# EAGLE schematic Pots (EAGLE 7.4.0)
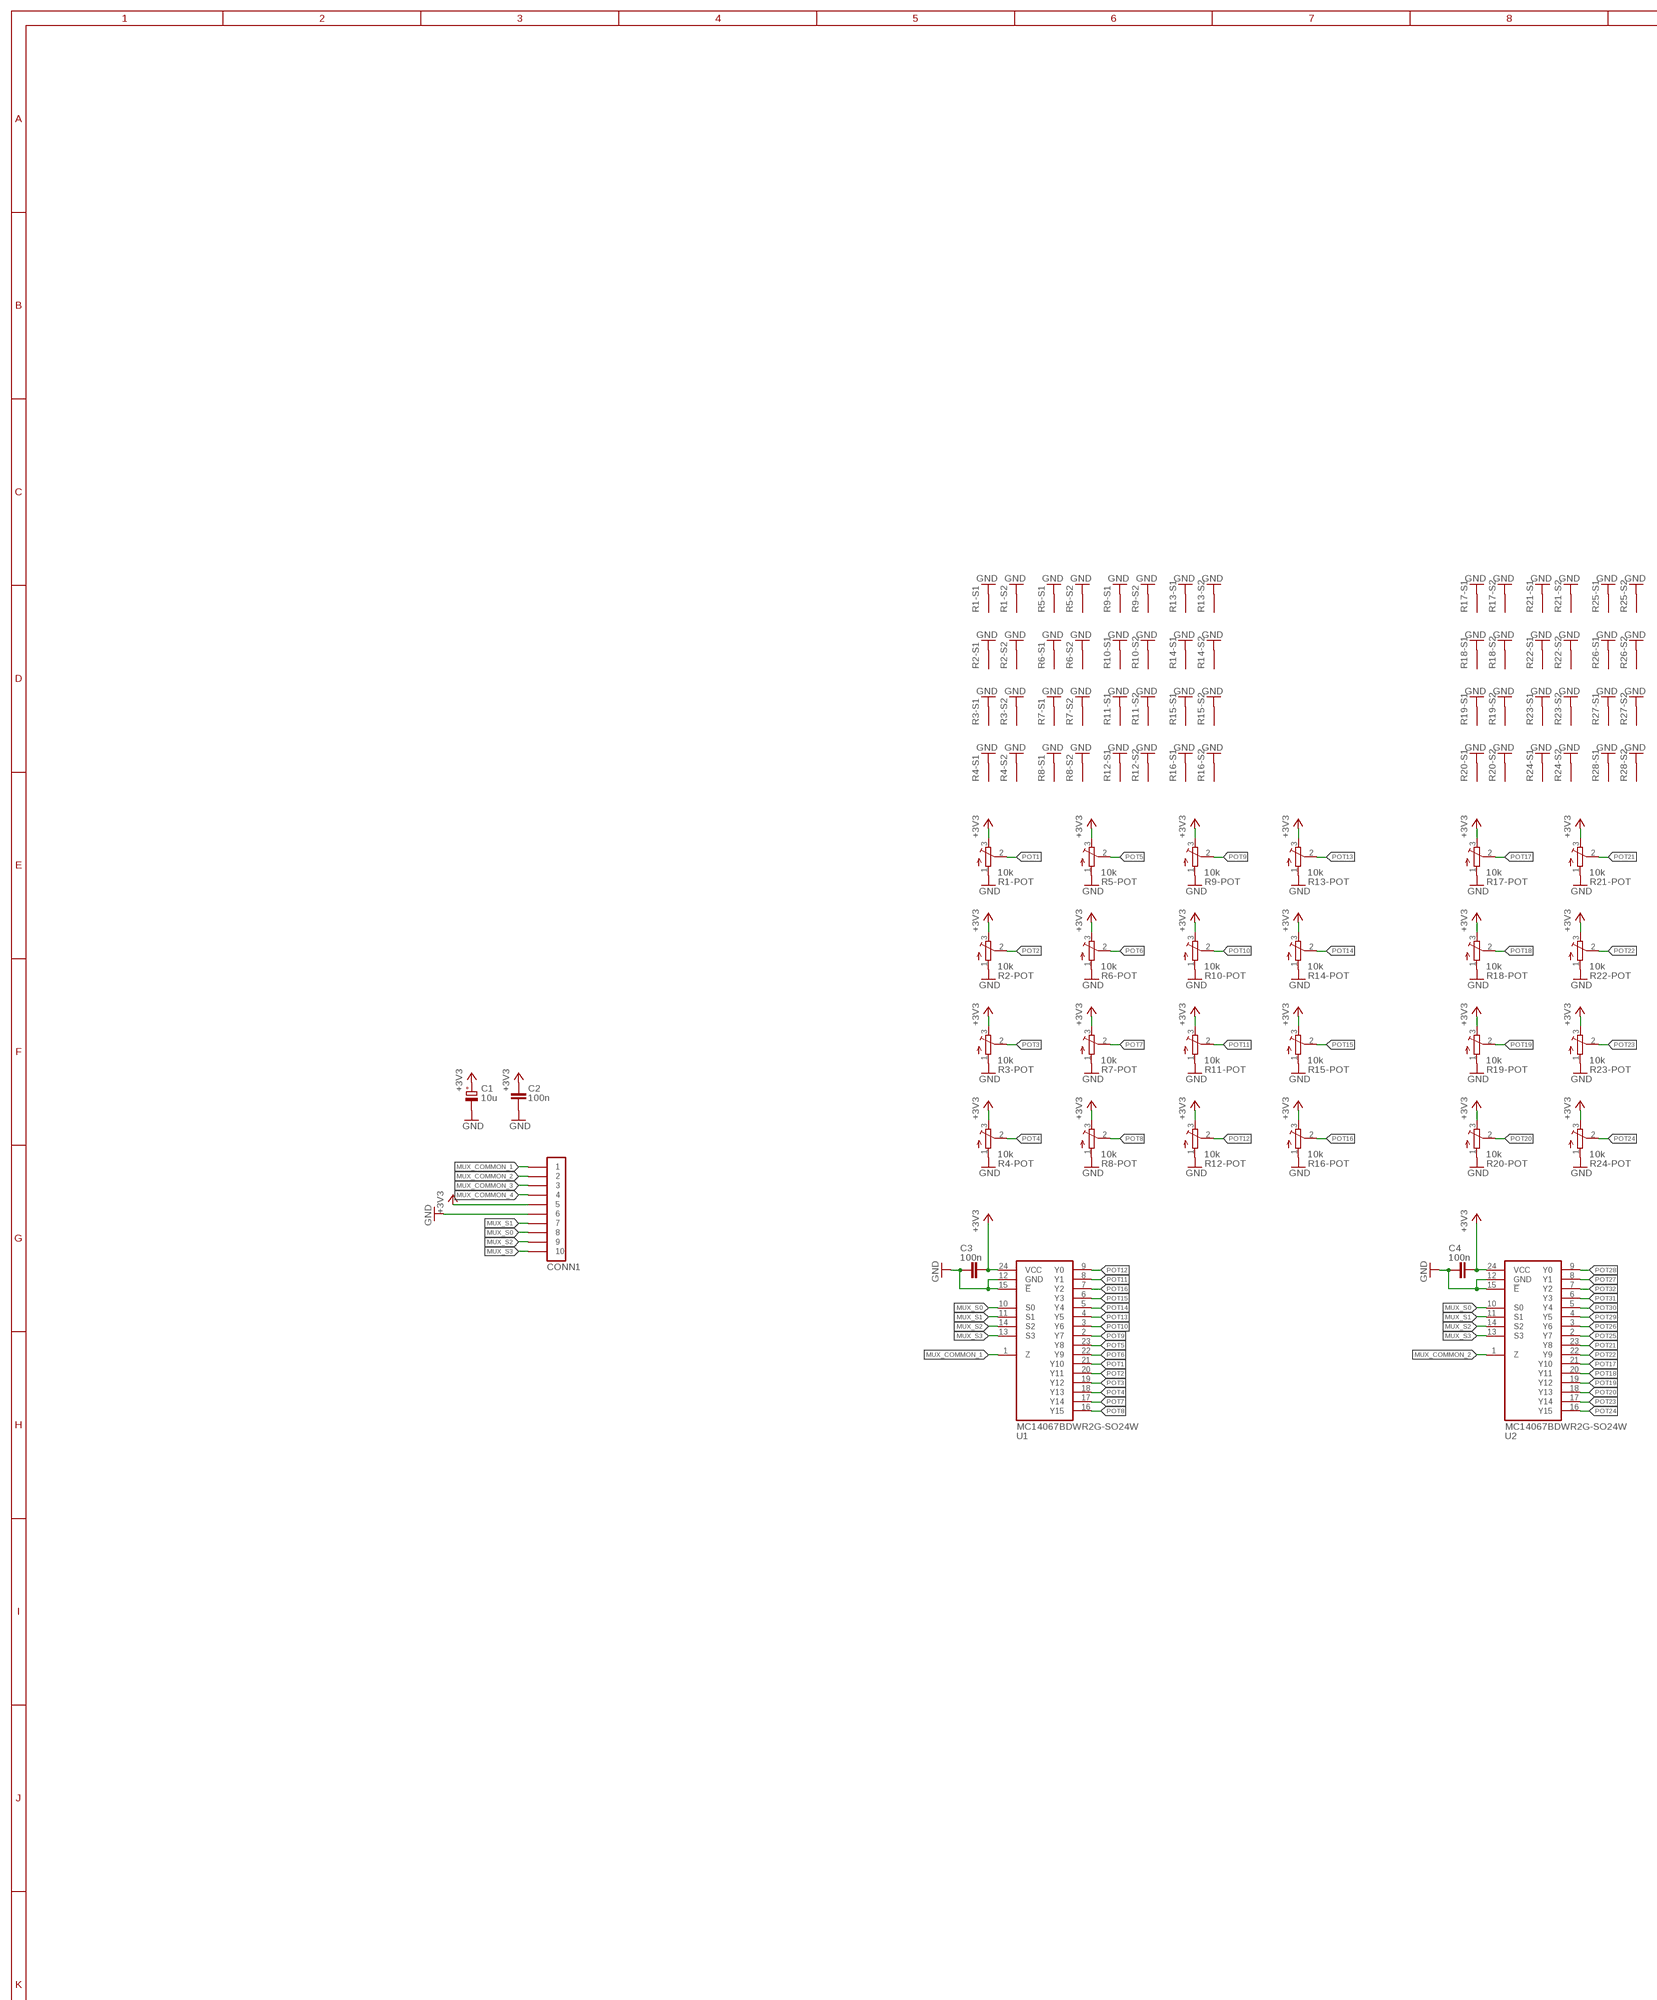
[diagram p0: schematic, sheet 1, part 1 of 3]
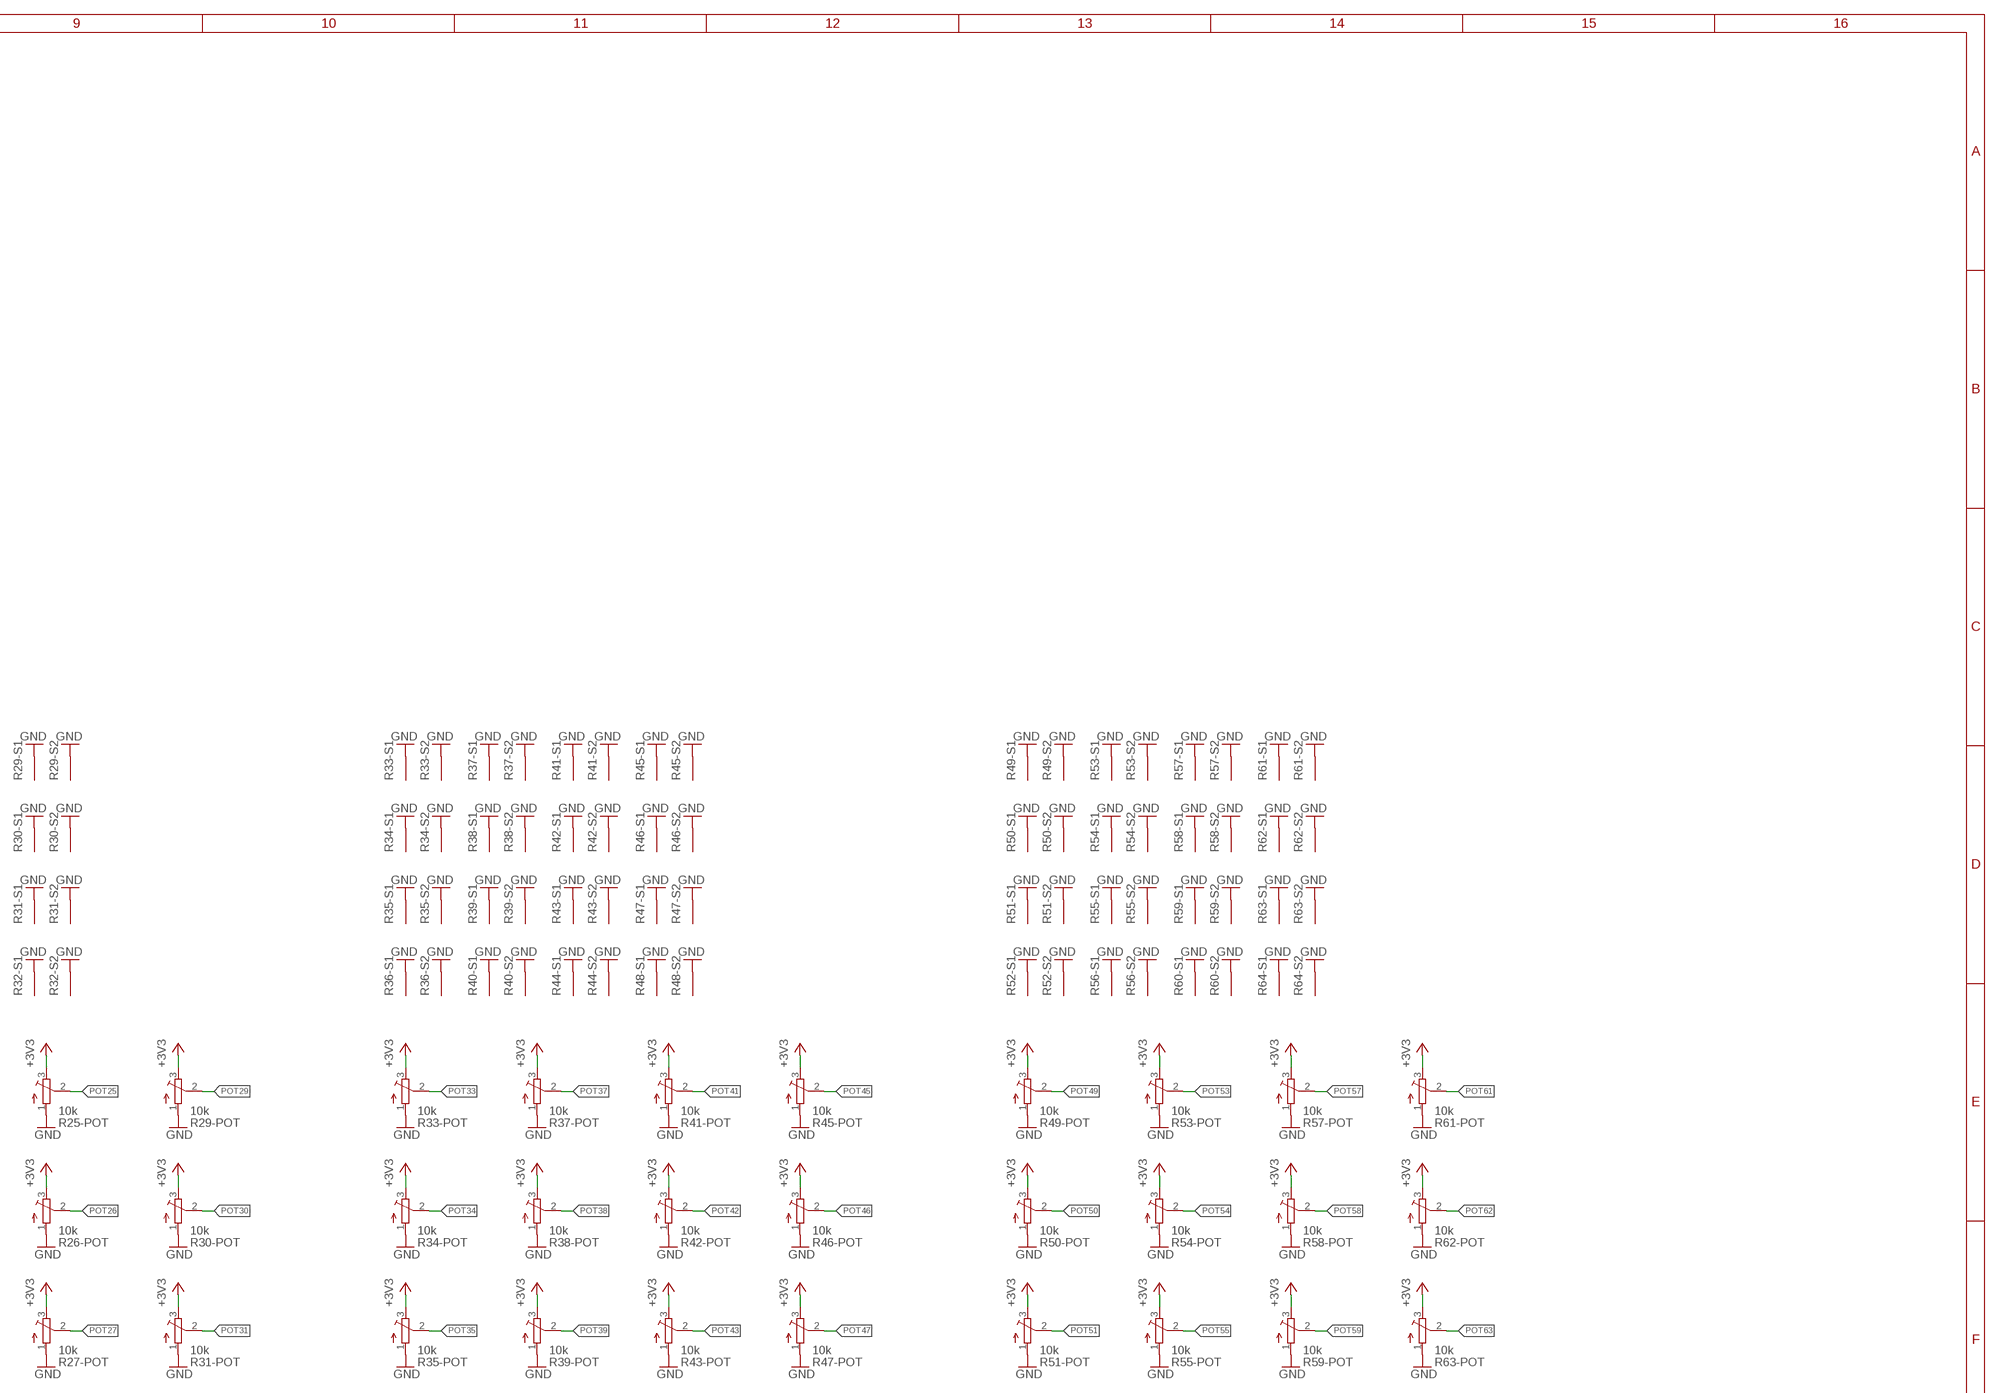
[diagram p1: schematic, sheet 1, part 2 of 3]
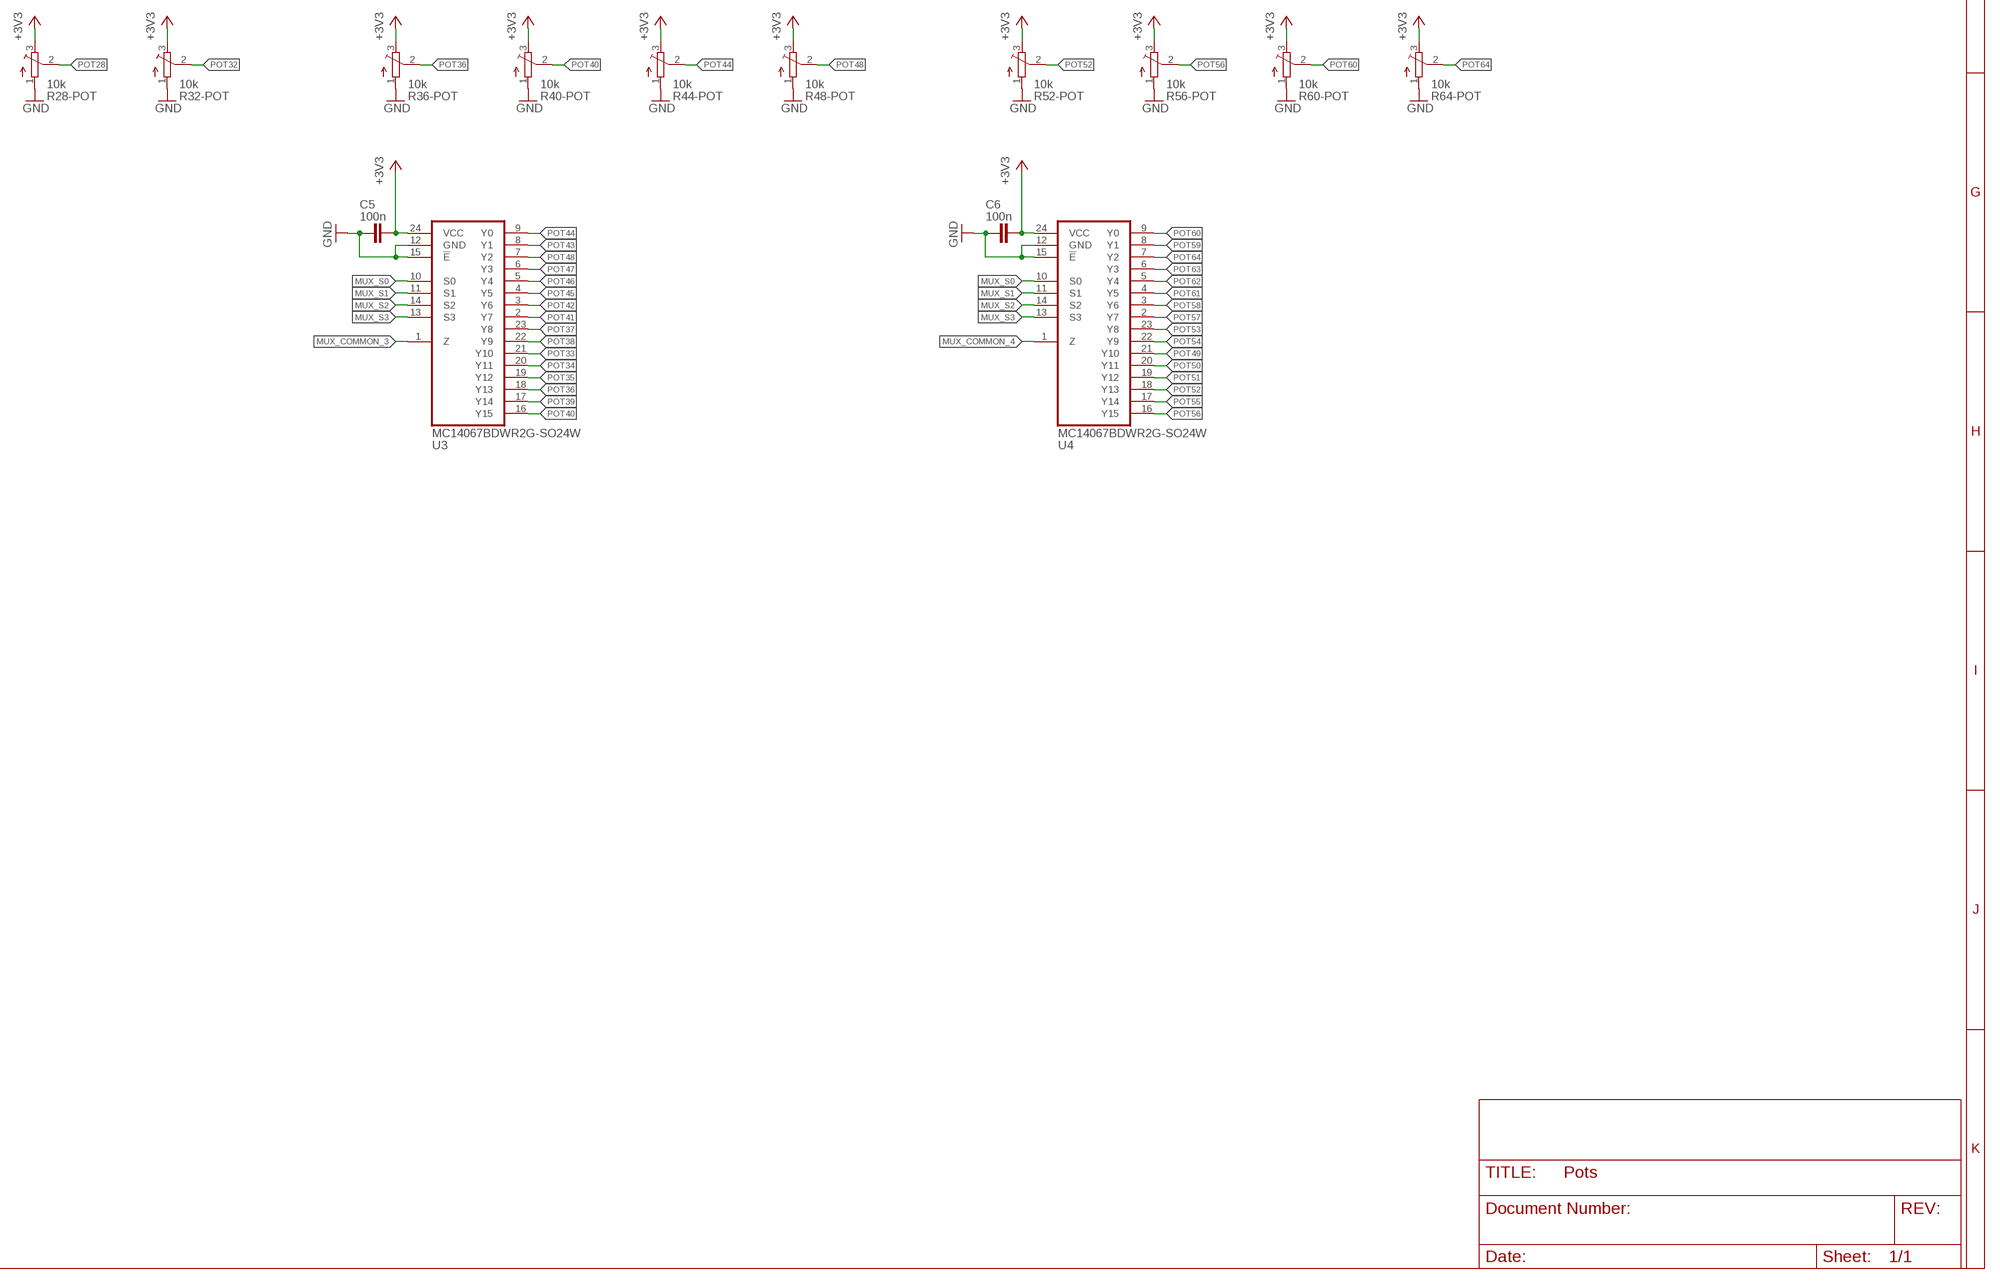
[diagram p2: schematic, sheet 1, part 3 of 3]

## Parts
C1  10u  ELECTROLYTIC_CAPACITOR-C-TH-E-0401  [C-TH-E-0401]
C2  100n  CAPACITOR-0805  [C0805]
C3  100n  CAPACITOR-0805  [C0805]
C4  100n  CAPACITOR-0805  [C0805]
C5  100n  CAPACITOR-0805  [C0805]
C6  100n  CAPACITOR-0805  [C0805]
CONN1  PINHD-1X10-FFC-1MM-Z  [MOLEX-52271-1079]
R1  10k  PTV09A-4025F-B103  [PTV09A-4025F-B103]
R2  10k  PTV09A-4025F-B103  [PTV09A-4025F-B103]
R3  10k  PTV09A-4025F-B103  [PTV09A-4025F-B103]
R4  10k  PTV09A-4025F-B103  [PTV09A-4025F-B103]
R5  10k  PTV09A-4025F-B103  [PTV09A-4025F-B103]
R6  10k  PTV09A-4025F-B103  [PTV09A-4025F-B103]
R7  10k  PTV09A-4025F-B103  [PTV09A-4025F-B103]
R8  10k  PTV09A-4025F-B103  [PTV09A-4025F-B103]
R9  10k  PTV09A-4025F-B103  [PTV09A-4025F-B103]
R10  10k  PTV09A-4025F-B103  [PTV09A-4025F-B103]
R11  10k  PTV09A-4025F-B103  [PTV09A-4025F-B103]
R12  10k  PTV09A-4025F-B103  [PTV09A-4025F-B103]
R13  10k  PTV09A-4025F-B103  [PTV09A-4025F-B103]
R14  10k  PTV09A-4025F-B103  [PTV09A-4025F-B103]
R15  10k  PTV09A-4025F-B103  [PTV09A-4025F-B103]
R16  10k  PTV09A-4025F-B103  [PTV09A-4025F-B103]
R17  10k  PTV09A-4025F-B103  [PTV09A-4025F-B103]
R18  10k  PTV09A-4025F-B103  [PTV09A-4025F-B103]
R19  10k  PTV09A-4025F-B103  [PTV09A-4025F-B103]
R20  10k  PTV09A-4025F-B103  [PTV09A-4025F-B103]
R21  10k  PTV09A-4025F-B103  [PTV09A-4025F-B103]
R22  10k  PTV09A-4025F-B103  [PTV09A-4025F-B103]
R23  10k  PTV09A-4025F-B103  [PTV09A-4025F-B103]
R24  10k  PTV09A-4025F-B103  [PTV09A-4025F-B103]
R25  10k  PTV09A-4025F-B103  [PTV09A-4025F-B103]
R26  10k  PTV09A-4025F-B103  [PTV09A-4025F-B103]
R27  10k  PTV09A-4025F-B103  [PTV09A-4025F-B103]
R28  10k  PTV09A-4025F-B103  [PTV09A-4025F-B103]
R29  10k  PTV09A-4025F-B103  [PTV09A-4025F-B103]
R30  10k  PTV09A-4025F-B103  [PTV09A-4025F-B103]
R31  10k  PTV09A-4025F-B103  [PTV09A-4025F-B103]
R32  10k  PTV09A-4025F-B103  [PTV09A-4025F-B103]
R33  10k  PTV09A-4025F-B103  [PTV09A-4025F-B103]
R34  10k  PTV09A-4025F-B103  [PTV09A-4025F-B103]
R35  10k  PTV09A-4025F-B103  [PTV09A-4025F-B103]
R36  10k  PTV09A-4025F-B103  [PTV09A-4025F-B103]
R37  10k  PTV09A-4025F-B103  [PTV09A-4025F-B103]
R38  10k  PTV09A-4025F-B103  [PTV09A-4025F-B103]
R39  10k  PTV09A-4025F-B103  [PTV09A-4025F-B103]
R40  10k  PTV09A-4025F-B103  [PTV09A-4025F-B103]
R41  10k  PTV09A-4025F-B103  [PTV09A-4025F-B103]
R42  10k  PTV09A-4025F-B103  [PTV09A-4025F-B103]
R43  10k  PTV09A-4025F-B103  [PTV09A-4025F-B103]
R44  10k  PTV09A-4025F-B103  [PTV09A-4025F-B103]
R45  10k  PTV09A-4025F-B103  [PTV09A-4025F-B103]
R46  10k  PTV09A-4025F-B103  [PTV09A-4025F-B103]
R47  10k  PTV09A-4025F-B103  [PTV09A-4025F-B103]
R48  10k  PTV09A-4025F-B103  [PTV09A-4025F-B103]
R49  10k  PTV09A-4025F-B103  [PTV09A-4025F-B103]
R50  10k  PTV09A-4025F-B103  [PTV09A-4025F-B103]
R51  10k  PTV09A-4025F-B103  [PTV09A-4025F-B103]
R52  10k  PTV09A-4025F-B103  [PTV09A-4025F-B103]
R53  10k  PTV09A-4025F-B103  [PTV09A-4025F-B103]
R54  10k  PTV09A-4025F-B103  [PTV09A-4025F-B103]
R55  10k  PTV09A-4025F-B103  [PTV09A-4025F-B103]
R56  10k  PTV09A-4025F-B103  [PTV09A-4025F-B103]
R57  10k  PTV09A-4025F-B103  [PTV09A-4025F-B103]
R58  10k  PTV09A-4025F-B103  [PTV09A-4025F-B103]
R59  10k  PTV09A-4025F-B103  [PTV09A-4025F-B103]
R60  10k  PTV09A-4025F-B103  [PTV09A-4025F-B103]
R61  10k  PTV09A-4025F-B103  [PTV09A-4025F-B103]
R62  10k  PTV09A-4025F-B103  [PTV09A-4025F-B103]
R63  10k  PTV09A-4025F-B103  [PTV09A-4025F-B103]
R64  10k  PTV09A-4025F-B103  [PTV09A-4025F-B103]
U1  MC14067BDWR2G-SO24W  [SO24-W]
U2  MC14067BDWR2G-SO24W  [SO24-W]
U3  MC14067BDWR2G-SO24W  [SO24-W]
U4  MC14067BDWR2G-SO24W  [SO24-W]

## Nets
+3V3: C1.+ C2.1 C3.2 C4.2 C5.2 C6.2 CONN1.5 R1.3 R2.3 R3.3 R4.3 R5.3 R6.3 R7.3 R8.3 R9.3 R10.3 R11.3 R12.3 R13.3 R14.3 R15.3 R16.3 R17.3 R18.3 R19.3 R20.3 R21.3 R22.3 R23.3 R24.3 R25.3 R26.3 R27.3 R28.3 R29.3 R30.3 R31.3 R32.3 R33.3 R34.3 R35.3 R36.3 R37.3 R38.3 R39.3 R40.3 R41.3 R42.3 R43.3 R44.3 R45.3 R46.3 R47.3 R48.3 R49.3 R50.3 R51.3 R52.3 R53.3 R54.3 R55.3 R56.3 R57.3 R58.3 R59.3 R60.3 R61.3 R62.3 R63.3 R64.3 U1.24(VCC) U2.24(VCC) U3.24(VCC) U4.24(VCC)
GND: C1.- C2.2 C3.1 C4.1 C5.1 C6.1 CONN1.6 R1.1 R1.S1(-S1:S) R1.S2(-S2:S) R2.1 R2.S1(-S1:S) R2.S2(-S2:S) R3.1 R3.S1(-S1:S) R3.S2(-S2:S) R4.1 R4.S1(-S1:S) R4.S2(-S2:S) R5.1 R5.S1(-S1:S) R5.S2(-S2:S) R6.1 R6.S1(-S1:S) R6.S2(-S2:S) R7.1 R7.S1(-S1:S) R7.S2(-S2:S) R8.1 R8.S1(-S1:S) R8.S2(-S2:S) R9.1 R9.S1(-S1:S) R9.S2(-S2:S) R10.1 R10.S1(-S1:S) R10.S2(-S2:S) R11.1 R11.S1(-S1:S) R11.S2(-S2:S) R12.1 R12.S1(-S1:S) R12.S2(-S2:S) R13.1 R13.S1(-S1:S) R13.S2(-S2:S) R14.1 R14.S1(-S1:S) R14.S2(-S2:S) R15.1 R15.S1(-S1:S) R15.S2(-S2:S) R16.1 R16.S1(-S1:S) R16.S2(-S2:S) R17.1 R17.S1(-S1:S) R17.S2(-S2:S) R18.1 R18.S1(-S1:S) R18.S2(-S2:S) R19.1 R19.S1(-S1:S) R19.S2(-S2:S) R20.1 R20.S1(-S1:S) R20.S2(-S2:S) R21.1 R21.S1(-S1:S) R21.S2(-S2:S) R22.1 R22.S1(-S1:S) R22.S2(-S2:S) R23.1 R23.S1(-S1:S) R23.S2(-S2:S) R24.1 R24.S1(-S1:S) R24.S2(-S2:S) R25.1 R25.S1(-S1:S) R25.S2(-S2:S) R26.1 R26.S1(-S1:S) R26.S2(-S2:S) R27.1 R27.S1(-S1:S) R27.S2(-S2:S) R28.1 R28.S1(-S1:S) R28.S2(-S2:S) R29.1 R29.S1(-S1:S) R29.S2(-S2:S) R30.1 R30.S1(-S1:S) R30.S2(-S2:S) R31.1 R31.S1(-S1:S) R31.S2(-S2:S) R32.1 R32.S1(-S1:S) R32.S2(-S2:S) R33.1 R33.S1(-S1:S) R33.S2(-S2:S) R34.1 R34.S1(-S1:S) R34.S2(-S2:S) R35.1 R35.S1(-S1:S) R35.S2(-S2:S) R36.1 R36.S1(-S1:S) R36.S2(-S2:S) R37.1 R37.S1(-S1:S) R37.S2(-S2:S) R38.1 R38.S1(-S1:S) R38.S2(-S2:S) R39.1 R39.S1(-S1:S) R39.S2(-S2:S) R40.1 R40.S1(-S1:S) R40.S2(-S2:S) R41.1 R41.S1(-S1:S) R41.S2(-S2:S) R42.1 R42.S1(-S1:S) R42.S2(-S2:S) R43.1 R43.S1(-S1:S) R43.S2(-S2:S) R44.1 R44.S1(-S1:S) R44.S2(-S2:S) R45.1 R45.S1(-S1:S) R45.S2(-S2:S) R46.1 R46.S1(-S1:S) R46.S2(-S2:S) R47.1 R47.S1(-S1:S) R47.S2(-S2:S) R48.1 R48.S1(-S1:S) R48.S2(-S2:S) R49.1 R49.S1(-S1:S) R49.S2(-S2:S) R50.1 R50.S1(-S1:S) R50.S2(-S2:S) R51.1 R51.S1(-S1:S) R51.S2(-S2:S) R52.1 R52.S1(-S1:S) R52.S2(-S2:S) R53.1 R53.S1(-S1:S) R53.S2(-S2:S) R54.1 R54.S1(-S1:S) R54.S2(-S2:S) R55.1 R55.S1(-S1:S) R55.S2(-S2:S) R56.1 R56.S1(-S1:S) R56.S2(-S2:S) R57.1 R57.S1(-S1:S) R57.S2(-S2:S) R58.1 R58.S1(-S1:S) R58.S2(-S2:S) R59.1 R59.S1(-S1:S) R59.S2(-S2:S) R60.1 R60.S1(-S1:S) R60.S2(-S2:S) R61.1 R61.S1(-S1:S) R61.S2(-S2:S) R62.1 R62.S1(-S1:S) R62.S2(-S2:S) R63.1 R63.S1(-S1:S) R63.S2(-S2:S) R64.1 R64.S1(-S1:S) R64.S2(-S2:S) U1.12(GND) U1.15(!E) U2.12(GND) U2.15(!E) U3.12(GND) U3.15(!E) U4.12(GND) U4.15(!E)
MUX_COMMON_1: CONN1.1 U1.1(Z)
MUX_COMMON_2: CONN1.2 U2.1(Z)
MUX_COMMON_3: CONN1.3 U3.1(Z)
MUX_COMMON_4: CONN1.4 U4.1(Z)
MUX_S0: CONN1.8 U1.10(S0) U2.10(S0) U3.10(S0) U4.10(S0)
MUX_S1: CONN1.7 U1.11(S1) U2.11(S1) U3.11(S1) U4.11(S1)
MUX_S2: CONN1.9 U1.14(S2) U2.14(S2) U3.14(S2) U4.14(S2)
MUX_S3: CONN1.10 U1.13(S3) U2.13(S3) U3.13(S3) U4.13(S3)
POT1: R1.2 U1.21(Y10)
POT2: R2.2 U1.20(Y11)
POT3: R3.2 U1.19(Y12)
POT4: R4.2 U1.18(Y13)
POT5: R5.2 U1.23(Y8)
POT6: R6.2 U1.22(Y9)
POT7: R7.2 U1.17(Y14)
POT8: R8.2 U1.16(Y15)
POT9: R9.2 U1.2(Y7)
POT10: R10.2 U1.3(Y6)
POT11: R11.2 U1.8(Y1)
POT12: R12.2 U1.9(Y0)
POT13: R13.2 U1.4(Y5)
POT14: R14.2 U1.5(Y4)
POT15: R15.2 U1.6(Y3)
POT16: R16.2 U1.7(Y2)
POT17: R17.2 U2.21(Y10)
POT18: R18.2 U2.20(Y11)
POT19: R19.2 U2.19(Y12)
POT20: R20.2 U2.18(Y13)
POT21: R21.2 U2.23(Y8)
POT22: R22.2 U2.22(Y9)
POT23: R23.2 U2.17(Y14)
POT24: R24.2 U2.16(Y15)
POT25: R25.2 U2.2(Y7)
POT26: R26.2 U2.3(Y6)
POT27: R27.2 U2.8(Y1)
POT28: R28.2 U2.9(Y0)
POT29: R29.2 U2.4(Y5)
POT30: R30.2 U2.5(Y4)
POT31: R31.2 U2.6(Y3)
POT32: R32.2 U2.7(Y2)
POT33: R33.2 U3.21(Y10)
POT34: R34.2 U3.20(Y11)
POT35: R35.2 U3.19(Y12)
POT36: R36.2 U3.18(Y13)
POT37: R37.2 U3.23(Y8)
POT38: R38.2 U3.22(Y9)
POT39: R39.2 U3.17(Y14)
POT40: R40.2 U3.16(Y15)
POT41: R41.2 U3.2(Y7)
POT42: R42.2 U3.3(Y6)
POT43: R43.2 U3.8(Y1)
POT44: R44.2 U3.9(Y0)
POT45: R45.2 U3.4(Y5)
POT46: R46.2 U3.5(Y4)
POT47: R47.2 U3.6(Y3)
POT48: R48.2 U3.7(Y2)
POT49: R49.2 U4.21(Y10)
POT50: R50.2 U4.20(Y11)
POT51: R51.2 U4.19(Y12)
POT52: R52.2 U4.18(Y13)
POT53: R53.2 U4.23(Y8)
POT54: R54.2 U4.22(Y9)
POT55: R55.2 U4.17(Y14)
POT56: R56.2 U4.16(Y15)
POT57: R57.2 U4.2(Y7)
POT58: R58.2 U4.3(Y6)
POT59: R59.2 U4.8(Y1)
POT60: R60.2 U4.9(Y0)
POT61: R61.2 U4.4(Y5)
POT62: R62.2 U4.5(Y4)
POT63: R63.2 U4.6(Y3)
POT64: R64.2 U4.7(Y2)

## Library data of the parts
C1 = igor_lbr:ELECTROLYTIC_CAPACITOR: Electrolytic capacitor
C2-C6 = igor_lbr:CAPACITOR: Capacitor
CONN1 = igor_lbr:PINHD-1X10: Pin header; MANUFACTURER: Molex; MPN: 52271-1079
R1-R64 = igor_lbr:PTV09A-4025F-B103: Potentiometer
U1-U4 = igor_lbr:MC14067BDWR2G: 16-Channel Analog Multiplexer/Demultiplexer; MANUFACTURER: ON Semiconductor; MPN: MC14067BDWR2G